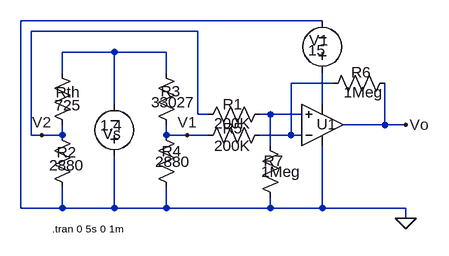
[diagram p0: schematic Draft2.asc]
Draft2.asc, the LTspice schematic file:
Version 4.1
SHEET 1 880 680
WIRE 384 -64 -80 -64
WIRE 192 -48 -64 -48
WIRE 64 -16 -16 -16
WIRE 144 -16 64 -16
WIRE -16 16 -16 -16
WIRE 144 16 144 -16
WIRE 400 32 336 32
WIRE 64 64 64 -16
WIRE 384 64 384 16
WIRE 192 80 192 -48
WIRE 208 80 192 80
WIRE 304 80 288 80
WIRE 352 80 304 80
WIRE 480 96 480 32
WIRE 480 96 416 96
WIRE 512 96 480 96
WIRE -64 112 -64 -48
WIRE -48 112 -64 112
WIRE -16 112 -16 96
WIRE -16 112 -48 112
WIRE 144 112 144 96
WIRE 176 112 144 112
WIRE 208 112 176 112
WIRE 336 112 336 32
WIRE 336 112 288 112
WIRE 352 112 336 112
WIRE 304 128 304 80
WIRE -80 224 -80 -64
WIRE -16 224 -16 192
WIRE -16 224 -80 224
WIRE 64 224 64 144
WIRE 64 224 -16 224
WIRE 144 224 144 192
WIRE 144 224 64 224
WIRE 304 224 304 208
WIRE 304 224 144 224
WIRE 384 224 384 128
WIRE 384 224 304 224
WIRE 512 224 384 224
WIRE 512 240 512 224
FLAG 512 240 0
FLAG 512 96 Vo
FLAG 176 112 V1
FLAG -48 112 V2
SYMBOL res -32 96 R0
WINDOW 0 7 42 Left 2
WINDOW 3 -4 62 Left 2
SYMATTR InstName R2
SYMATTR Value 2880
SYMBOL res 128 96 R0
WINDOW 0 9 41 Left 2
WINDOW 3 -1 57 Left 2
SYMATTR InstName R4
SYMATTR Value 2880
SYMBOL res 128 0 R0
WINDOW 0 7 44 Left 2
WINDOW 3 -7 61 Left 2
SYMATTR InstName R3
SYMATTR Value 33027
SYMBOL voltage 64 160 R180
WINDOW 0 -10 50 Left 2
WINDOW 3 -12 63 Left 2
WINDOW 123 0 0 Left 0
WINDOW 39 0 0 Left 0
SYMATTR InstName Vs
SYMATTR Value 1.4
SYMBOL res -32 0 R0
WINDOW 0 6 46 Left 2
WINDOW 3 4 66 Left 2
SYMATTR InstName Rth
SYMATTR Value 725
SYMBOL OpAmps\\UniversalOpAmp 384 96 M180
WINDOW 0 -9 1 Left 2
SYMATTR InstName U1
SYMBOL res 304 64 R90
WINDOW 0 16 58 VBottom 2
WINDOW 3 14 58 VTop 2
SYMATTR InstName R1
SYMATTR Value 200K
SYMBOL res 304 96 R90
WINDOW 0 21 58 VBottom 2
WINDOW 3 17 58 VTop 2
SYMATTR InstName R5
SYMATTR Value 200K
SYMBOL res 496 16 R90
WINDOW 0 15 52 VBottom 2
WINDOW 3 14 49 VTop 2
SYMATTR InstName R6
SYMATTR Value 1Meg
SYMBOL res 288 112 R0
WINDOW 0 6 39 Left 2
WINDOW 3 2 56 Left 2
SYMATTR InstName R7
SYMATTR Value 1Meg
SYMBOL voltage 384 32 R180
WINDOW 0 -9 66 Left 2
WINDOW 3 -5 51 Left 2
SYMATTR InstName V1
SYMATTR Value 15
TEXT -32 256 Left 1 !.tran 0 5s 0 1m

The netlist it stands for:
* Draft2.asc
R2 V2 0 2880
R4 V1 0 2880
R3 N001 V1 33027
Vs 0 N001 1.4
Rth N001 V2 725
X§U1 N004 N002 0 N003 Vo level1 Avol=1Meg GBW=10Meg Vos=0 En=0 Enk=0 In=0 Ink=0 Rin=500Meg  ; pins In+ In- V+ V- OUT
R1 N004 V2 200K
R5 N002 V1 200K
R6 Vo N002 1Meg
R7 N004 0 1Meg
V1 N003 0 15
.tran 0 5s 0 1m
.lib UniversalOpAmp1.lib
.backanno
.end